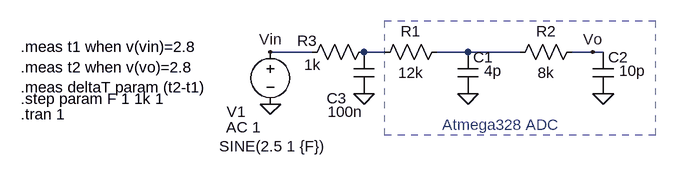
[diagram p0: schematic ADC RC Analysis.asc]
ADC RC Analysis.asc, the LTspice schematic file:
Version 4
SHEET 1 880 680
WIRE 0 128 -64 128
WIRE 112 128 80 128
WIRE 240 128 192 128
WIRE 320 128 240 128
WIRE 432 128 400 128
WIRE 448 128 432 128
FLAG 240 192 0
FLAG 448 192 0
FLAG 432 128 Vo
FLAG -64 208 0
FLAG 80 192 0
FLAG -64 128 Vin
SYMBOL cap 224 128 R0
WINDOW 3 41 29 Left 2
SYMATTR Value 4p
SYMATTR InstName C1
SYMBOL res 208 112 R90
WINDOW 0 0 56 VBottom 2
WINDOW 3 32 56 VTop 2
SYMATTR InstName R1
SYMATTR Value 12k
SYMBOL cap 432 128 R0
WINDOW 3 41 29 Left 2
SYMATTR Value 10p
SYMATTR InstName C2
SYMBOL res 416 112 R90
WINDOW 0 0 56 VBottom 2
WINDOW 3 32 56 VTop 2
SYMATTR InstName R2
SYMATTR Value 8k
SYMBOL voltage -64 112 R0
WINDOW 3 -79 161 Left 2
WINDOW 123 -68 132 Left 2
WINDOW 39 0 0 Left 0
WINDOW 0 -67 108 Left 2
SYMATTR Value SINE(2.5 1 {F})
SYMATTR Value2 AC 1
SYMATTR InstName V1
SYMBOL res 96 112 R90
WINDOW 0 14 103 VBottom 2
WINDOW 3 20 95 VTop 2
SYMATTR InstName R3
SYMATTR Value 1k
SYMBOL cap 64 128 R0
WINDOW 0 -41 71 Left 2
WINDOW 3 -40 92 Left 2
SYMATTR InstName C3
SYMATTR Value 100n
TEXT -448 224 Left 2 !.tran 1
TEXT -448 120 Left 2 !.meas t1 when v(vin)=2.8\n.meas t2 when v(vo)=2.8\n.meas deltaT param (t2-t1)
TEXT -448 200 Left 2 !.step param F 1 1k 1
TEXT 200 240 Left 2 ;Atmega328 ADC
RECTANGLE Normal 528 256 112 80 2

The netlist it stands for:
* ADC RC Analysis.asc
C1 N002 0 4p
R1 N002 N001 12k
C2 Vo 0 10p
R2 Vo N002 8k
V1 Vin 0 SINE(2.5 1 {F}) AC 1
R3 N001 Vin 1k
C3 N001 0 100n
.tran 1
.meas t1 when v(vin)=2.8
.meas t2 when v(vo)=2.8
.meas deltaT param (t2-t1)
.step param F 1 1k 1
* Atmega328 ADC
.backanno
.end